# EAGLE design SEGmeterShield15 (EAGLE 6.2)
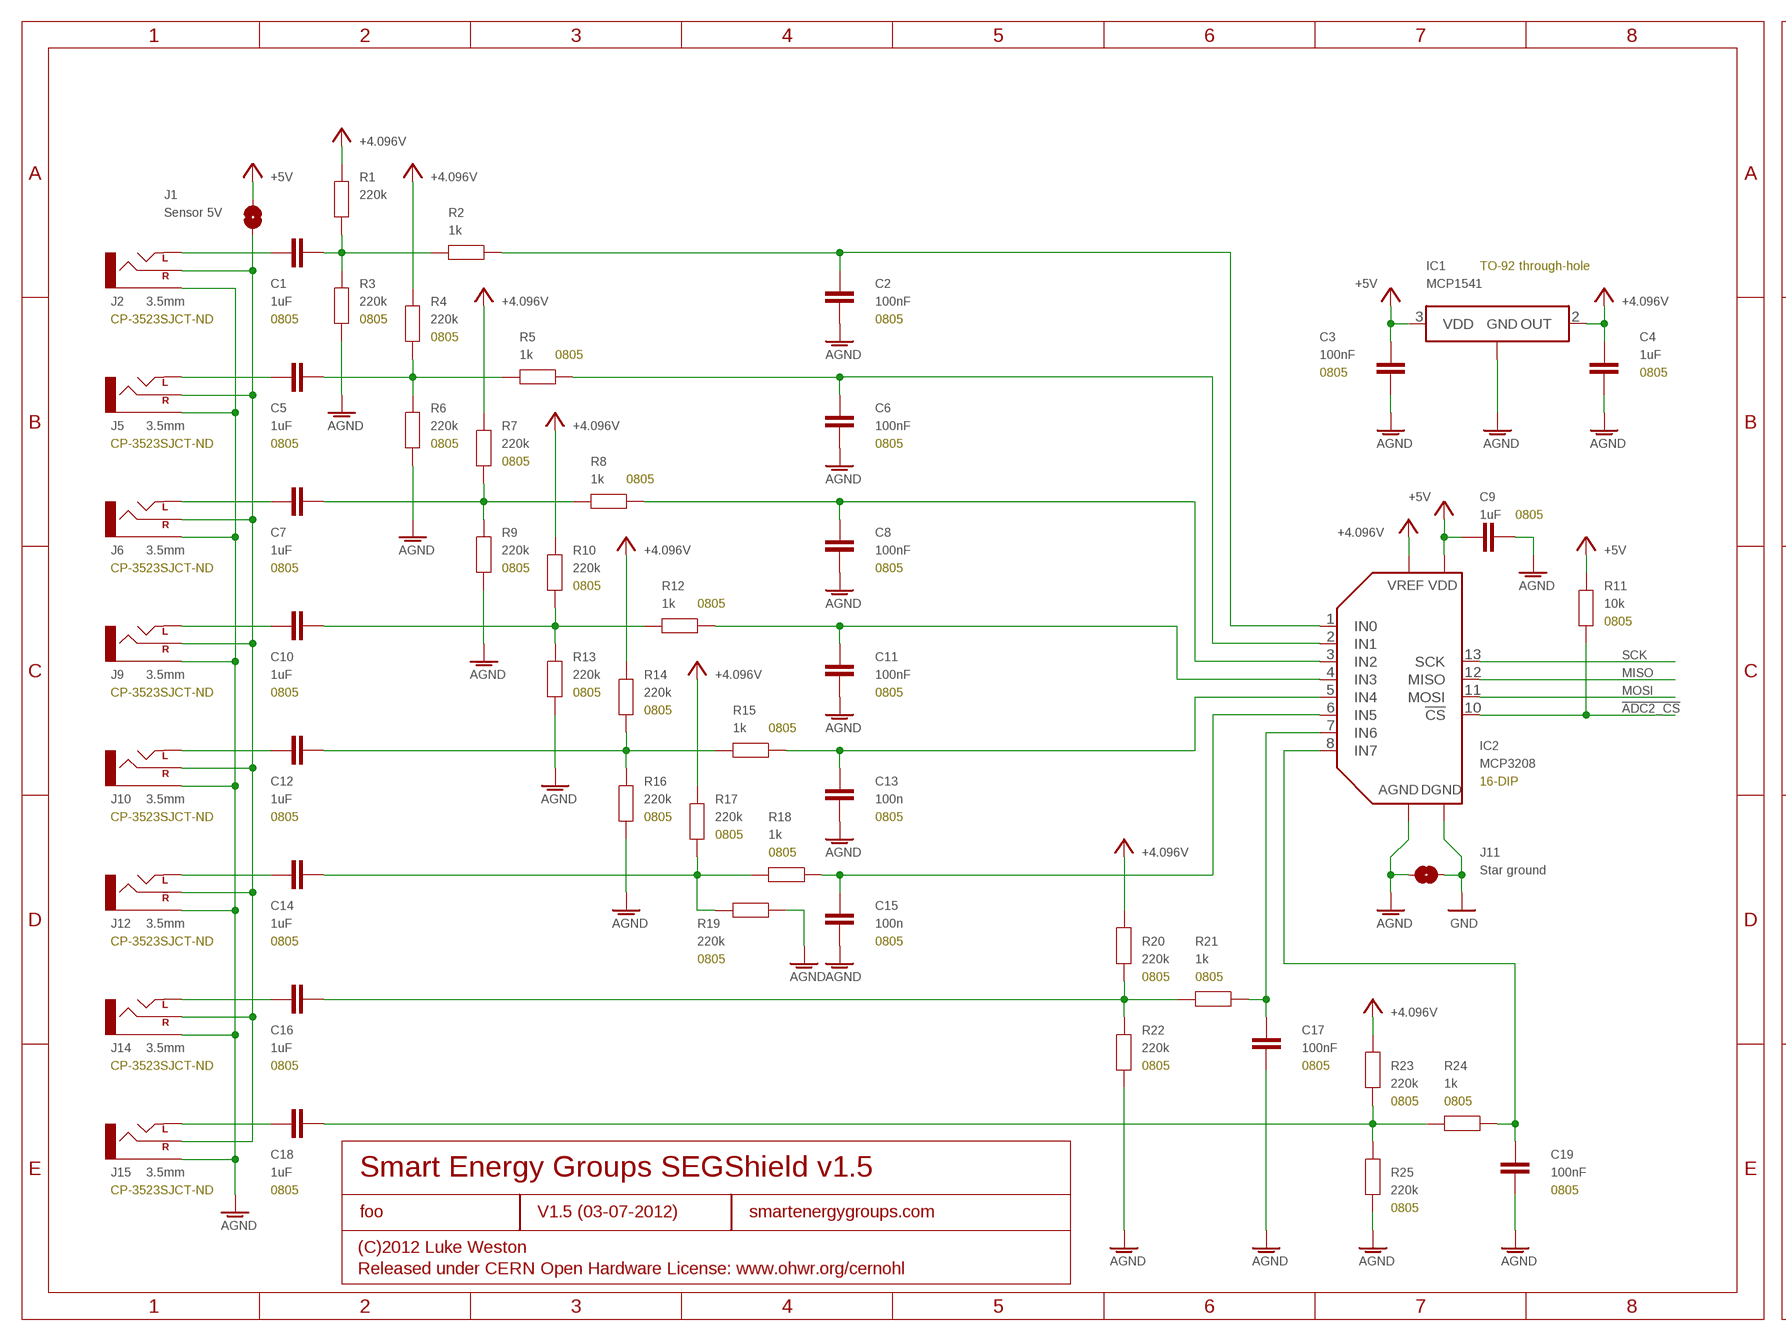
[diagram p0: schematic, sheet 1, part 1 of 2]
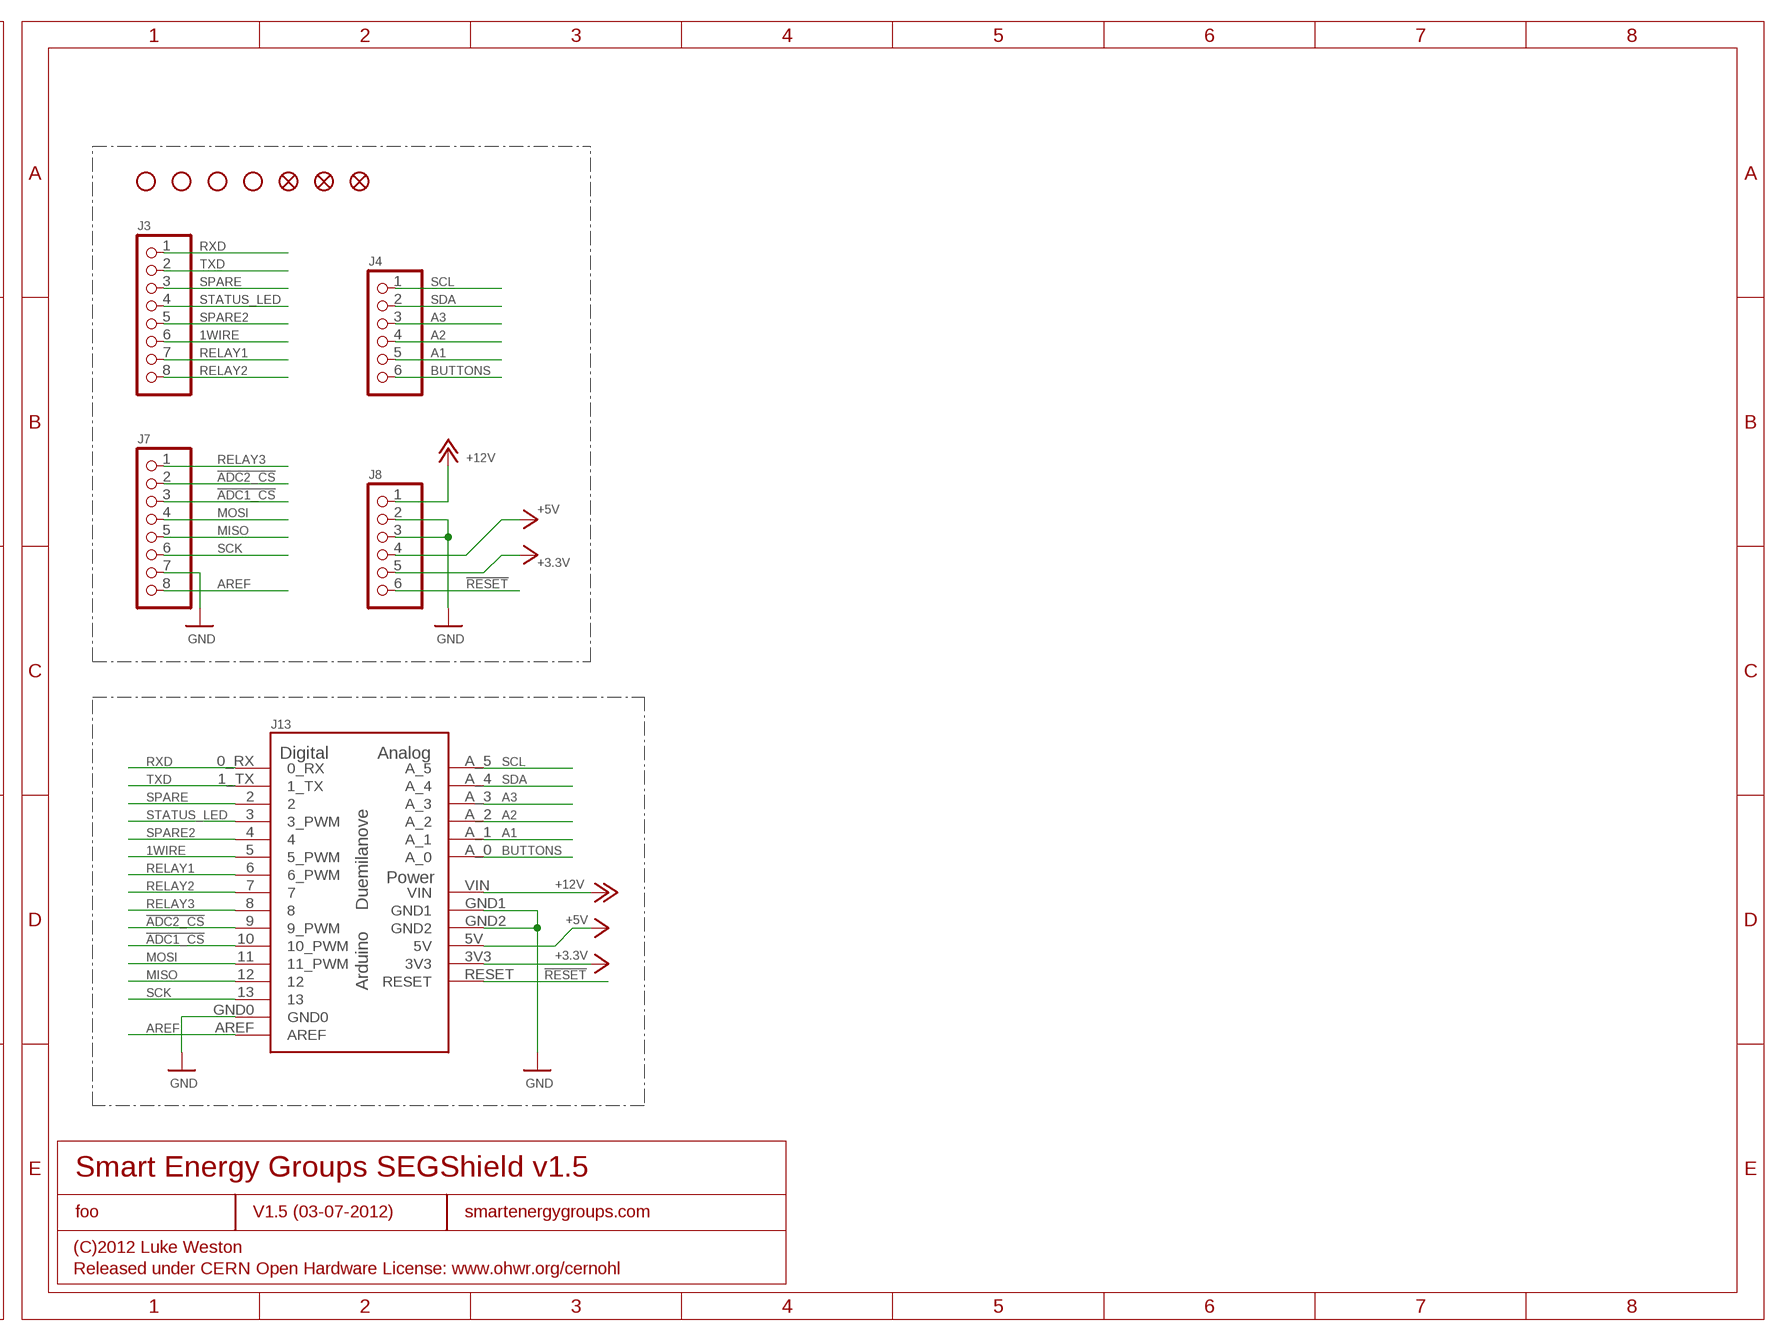
[diagram p1: schematic, sheet 1, part 2 of 2]

## Parts
C1  1uF  CAP0805  [0805]
C2  100nF  CAP0805  [0805]
C3  100nF  CAP0805  [0805]
C4  1uF  CAP0805  [0805]
C5  1uF  CAP0805  [0805]
C6  100nF  CAP0805  [0805]
C7  1uF  CAP0805  [0805]
C8  100nF  CAP0805  [0805]
C9  1uF  CAP0805  [0805]
C10  1uF  CAP0805  [0805]
C11  100nF  CAP0805  [0805]
C12  1uF  CAP0805  [0805]
C13  100n  CAP0805  [0805]
C14  1uF  CAP0805  [0805]
C15  100n  CAP0805  [0805]
C16  1uF  CAP0805  [0805]
C17  100nF  CAP0805  [0805]
C18  1uF  CAP0805  [0805]
C19  100nF  CAP0805  [0805]
IC1  MCP1541  [TO92-STRAIGHT]
IC2  MCP3208  MCP3208DIL  [DIL16]
J1  Sensor 5V  SJ  [SJ]
J2  3.5mm  AUDIO-JACKSMD2  [AUDIO-JACK-3.5MM-SMD]
J3  PINHD-1X8  [1X08]
J4  PINHD-1X6  [1X06]
J5  3.5mm  AUDIO-JACKSMD2  [AUDIO-JACK-3.5MM-SMD]
J6  3.5mm  AUDIO-JACKSMD2  [AUDIO-JACK-3.5MM-SMD]
J7  PINHD-1X8  [1X08]
J8  PINHD-1X6  [1X06]
J9  3.5mm  AUDIO-JACKSMD2  [AUDIO-JACK-3.5MM-SMD]
J10  3.5mm  AUDIO-JACKSMD2  [AUDIO-JACK-3.5MM-SMD]
J11  Star ground  SJ  [SJ]
J12  3.5mm  AUDIO-JACKSMD2  [AUDIO-JACK-3.5MM-SMD]
J13  Arduino-compatible headers  ARDUINO-USBNO-OUTLINE-NO-TEXT-OCTAGONAL  [NO-OUTLINE-OCTAGONAL-NOTEXT]
J14  3.5mm  AUDIO-JACKSMD2  [AUDIO-JACK-3.5MM-SMD]
J15  3.5mm  AUDIO-JACKSMD2  [AUDIO-JACK-3.5MM-SMD]
JP1  STAND-OFF  [STAND-OFF]
JP2  STAND-OFF  [STAND-OFF]
JP3  STAND-OFF  [STAND-OFF]
JP4  STAND-OFF  [STAND-OFF]
JP5  FIDUCIAL1.5X3  [FIDUCIAL-1.5X3]
JP6  FIDUCIAL1.5X3  [FIDUCIAL-1.5X3]
JP7  FIDUCIAL1.5X3  [FIDUCIAL-1.5X3]
R1  220k  RESISTOR0805  [0805]
R2  1k  RESISTOR0805  [0805]
R3  220k  RESISTOR0805  [0805]
R4  220k  RESISTOR0805  [0805]
R5  1k  RESISTOR0805  [0805]
R6  220k  RESISTOR0805  [0805]
R7  220k  RESISTOR0805  [0805]
R8  1k  RESISTOR0805  [0805]
R9  220k  RESISTOR0805  [0805]
R10  220k  RESISTOR0805  [0805]
R11  10k  RESISTOR0805  [0805]
R12  1k  RESISTOR0805  [0805]
R13  220k  RESISTOR0805  [0805]
R14  220k  RESISTOR0805  [0805]
R15  1k  RESISTOR0805  [0805]
R16  220k  RESISTOR0805  [0805]
R17  220k  RESISTOR0805  [0805]
R18  1k  RESISTOR0805  [0805]
R19  220k  RESISTOR0805  [0805]
R20  220k  RESISTOR0805  [0805]
R21  1k  RESISTOR0805  [0805]
R22  220k  RESISTOR0805  [0805]
R23  220k  RESISTOR0805  [0805]
R24  1k  RESISTOR0805  [0805]
R25  220k  RESISTOR0805  [0805]

## Nets
1WIRE: J3.6 J13.5(5_PWM)
!ADC1_CS: J7.3 J13.10(10_PWM)
!ADC2_CS: IC2.10(!CS) J7.2 J13.9(9_PWM) R11.1
!RESET: J8.6 J13.RESET
+3V3: J8.5 J13.3V3 ; supply symbol labelled +3.3V
+5V: C3.2 C9.2 IC1.3(VDD) IC2.16(VDD) J1.2 J8.4 J13.5V R11.2
+12V: J8.1 J13.VIN
A1: J4.5 J13.A_1
A2: J4.4 J13.A_2
A3: J4.3 J13.A_3
AGND: C2.1 C3.1 C4.1 C6.1 C8.1 C9.1 C11.1 C13.1 C15.1 C17.1 C19.1 IC1.1(GND) IC2.14(AGND) J2.SLEEVE J5.SLEEVE J6.SLEEVE J9.SLEEVE J10.SLEEVE J11.2 J12.SLEEVE J14.SLEEVE J15.SLEEVE R3.1 R6.1 R9.1 R13.1 R16.1 R19.1 R22.1 R25.1
AREF: J7.8 J13.AREF
BUTTONS: J4.6 J13.A_0
GND: IC2.9(DGND) J7.7 J8.2 J8.3 J11.1 J13.GND0 J13.GND1 J13.GND2
MISO: IC2.12(MISO) J7.5 J13.12
MOSI: IC2.11(MOSI) J7.4 J13.11(11_PWM)
N$30: C18.1 J15.TIP(LEFT)
N$41: C16.1 J14.TIP(LEFT)
N$42: C1.1 J2.TIP(LEFT)
N$44: C5.1 J5.TIP(LEFT)
N$45: C14.1 J12.TIP(LEFT)
N$46: J1.1 J2.RING(RIGHT) J5.RING(RIGHT) J6.RING(RIGHT) J9.RING(RIGHT) J10.RING(RIGHT) J12.RING(RIGHT) J14.RING(RIGHT) J15.RING(RIGHT)
N$47: C12.1 J10.TIP(LEFT)
N$48: C10.1 J9.TIP(LEFT)
N$49: C7.1 J6.TIP(LEFT)
N$50: C1.2 R1.1 R2.2 R3.2
N$51: C18.2 R23.1 R24.2 R25.2
N$52: C16.2 R20.1 R21.2 R22.2
N$53: C14.2 R17.1 R18.2 R19.2
N$54: C12.2 R14.1 R15.2 R16.2
N$55: C5.2 R4.1 R5.2 R6.2
N$56: C7.2 R7.1 R8.2 R9.2
N$57: C10.2 R10.1 R12.2 R13.2
N$59: C17.2 IC2.7(IN6) R21.1
N$60: C6.2 IC2.2(IN1) R5.1
N$62: C8.2 IC2.3(IN2) R8.1
N$63: C11.2 IC2.4(IN3) R12.1
N$64: C13.2 IC2.5(IN4) R15.1
N$65: C19.2 IC2.8(IN7) R24.1
N$67: C15.2 IC2.6(IN5) R18.1
N$70: C2.2 IC2.1(IN0) R2.1
RELAY1: J3.7 J13.6(6_PWM)
RELAY2: J3.8 J13.7
RELAY3: J7.1 J13.8
RXD: J3.1 J13.0_RX
SCK: IC2.13(SCK) J7.6 J13.13
SCL: J4.1 J13.A_5
SDA: J4.2 J13.A_4
SPARE: J3.3 J13.2
SPARE2: J3.5 J13.4
STATUS_LED: J3.4 J13.3(3_PWM)
TXD: J3.2 J13.1_TX
V+: C4.2 IC1.2(OUT) IC2.15(VREF) R1.2 R4.2 R7.2 R10.2 R14.2 R17.2 R20.2 R23.2 ; supply symbol labelled +4.096V

## Notes on the sheet
- TO-92 through-hole
- CP-3523SJCT-ND | 0805 | 0805 | 0805
- 0805
- 0805
- 0805 | 0805
- CP-3523SJCT-ND | 0805 | 0805 | 0805
- 0805
- 0805
- 0805
- CP-3523SJCT-ND | 0805 | 0805 | 0805
- 0805
- 0805
- 0805
- CP-3523SJCT-ND | 0805 | 0805 | 0805
- 0805
- 0805
- 16-DIP
- CP-3523SJCT-ND | 0805 | 0805 | 0805
- 0805
- 0805
- CP-3523SJCT-ND | 0805 | 0805
- 0805
- 0805 | 0805
- CP-3523SJCT-ND | 0805 | 0805 | 0805
- 0805 | 0805
- Smart Energy Groups SEGShield v1.5 | Smart Energy Groups SEGShield v1.5
- CP-3523SJCT-ND | 0805 | 0805
- 0805
- foo | V1.5 (03-07-2012) | smartenergygroups.com | foo | V1.5 (03-07-2012) | smartenergygroups.com
- (C)2012 Luke Weston | (C)2012 Luke Weston
- Released under CERN Open Hardware License: www.ohwr.org/cernohl | Released under CERN Open Hardware License: www.ohwr.org/cernohl

## Library data of the parts
C1-C19 = freetronics-master-v1:CAP: Capacitor Standard 0603 ceramic capacitor, and 0.1" leaded capacitor.
IC1 = freetronics-luke:MCP1541: Microchip MCP1541 4.096V voltage reference.
IC2 = Luke:MCP3208
J1 J11 = freetronics-luke:SJ: PCB "solder jumper". Note that there should nothing on the BOM corresponding to this "component".
J2 J5 J6 J9 J10 J12 J14 J15 = SparkFun:AUDIO-JACK: 3.5mm Audio Jack Simple 3.5mm common PCB mount audio jack. SKU: PRT-08032
J3 J7 = pinhead:PINHD-1X8: PIN HEADER
J4 J8 = pinhead:PINHD-1X6: PIN HEADER
J13 = Arduino-Various:ARDUINO-USB: The Ardiuno Duemilanove Pinouts layoutet as a Bare Shield. v0.5 Also for Arduino Diecimila. This is designed as a Part and has no Outline in the Dimension Layer. The Outline, when present, is drawed at the tPlace / bPlace Layer. Library by Stephanie Lange, http://www.k-ita.de/~sl/
JP1-JP4 = SparkFun:STAND-OFF: Stand Off This is the mechanical footprint for a #4 phillips button head screw. Use the keepout ring to avoid running the screw head into surrounding components. SKU : PRT-00447
JP5-JP7 = SparkFun:FIDUCIAL: Fiducial Alignment Points Various fiducial points for machine vision alignment.
R1-R25 = freetronics-master-v1:RESISTOR: Resistor Basic schematic elements and footprints for 0603, 1206, and PTH 1/10th watt (small) resistors.

## Board
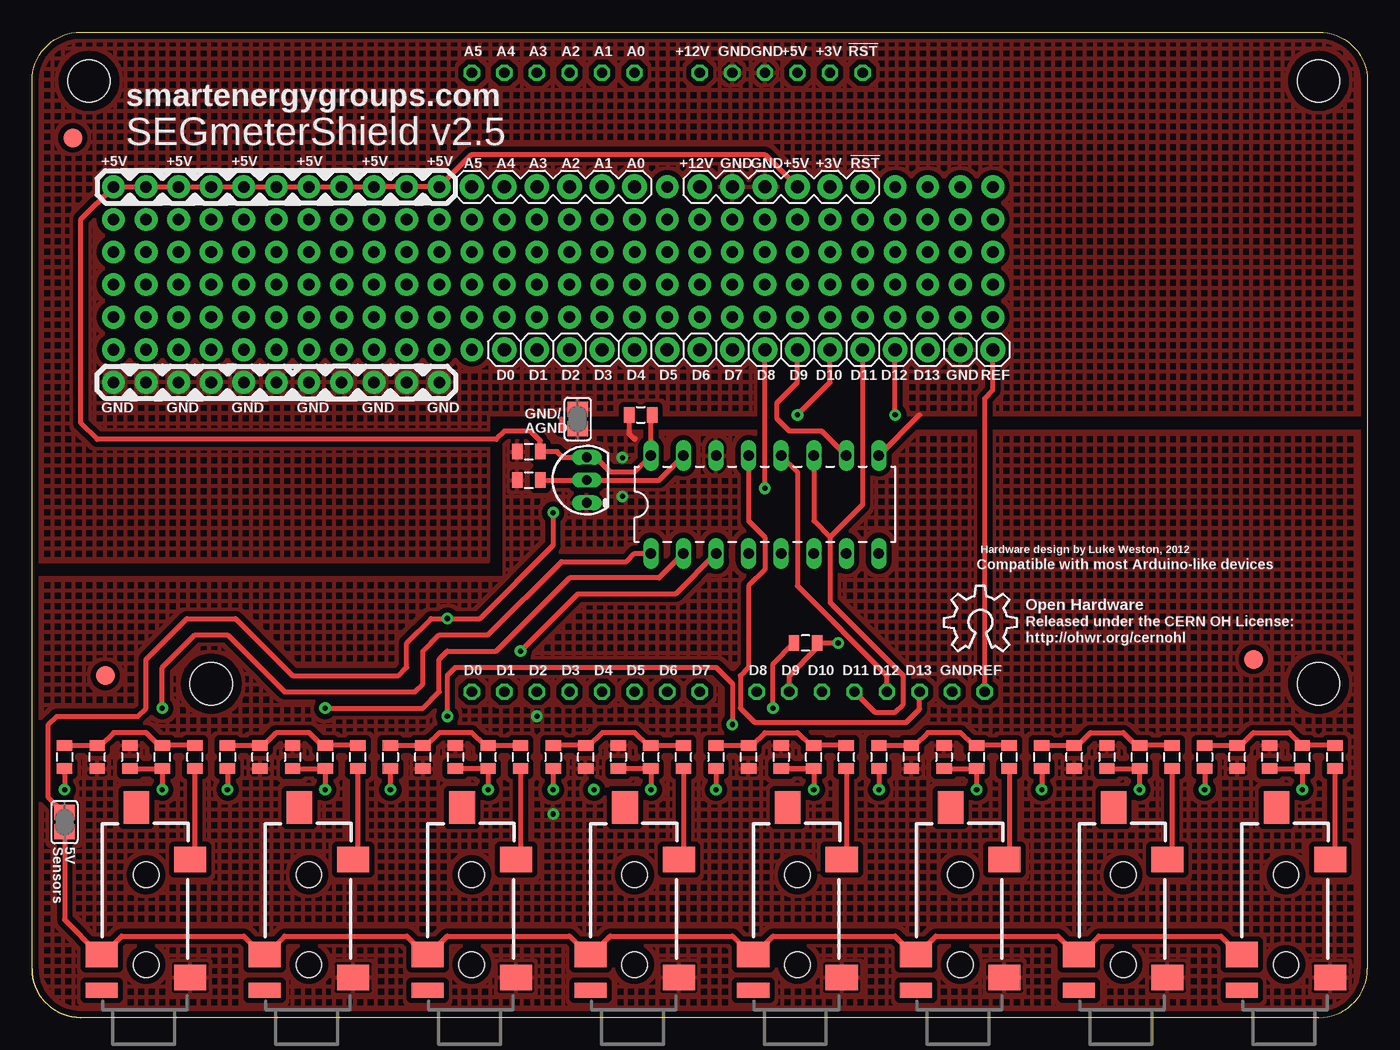
[diagram p2: board, top side]
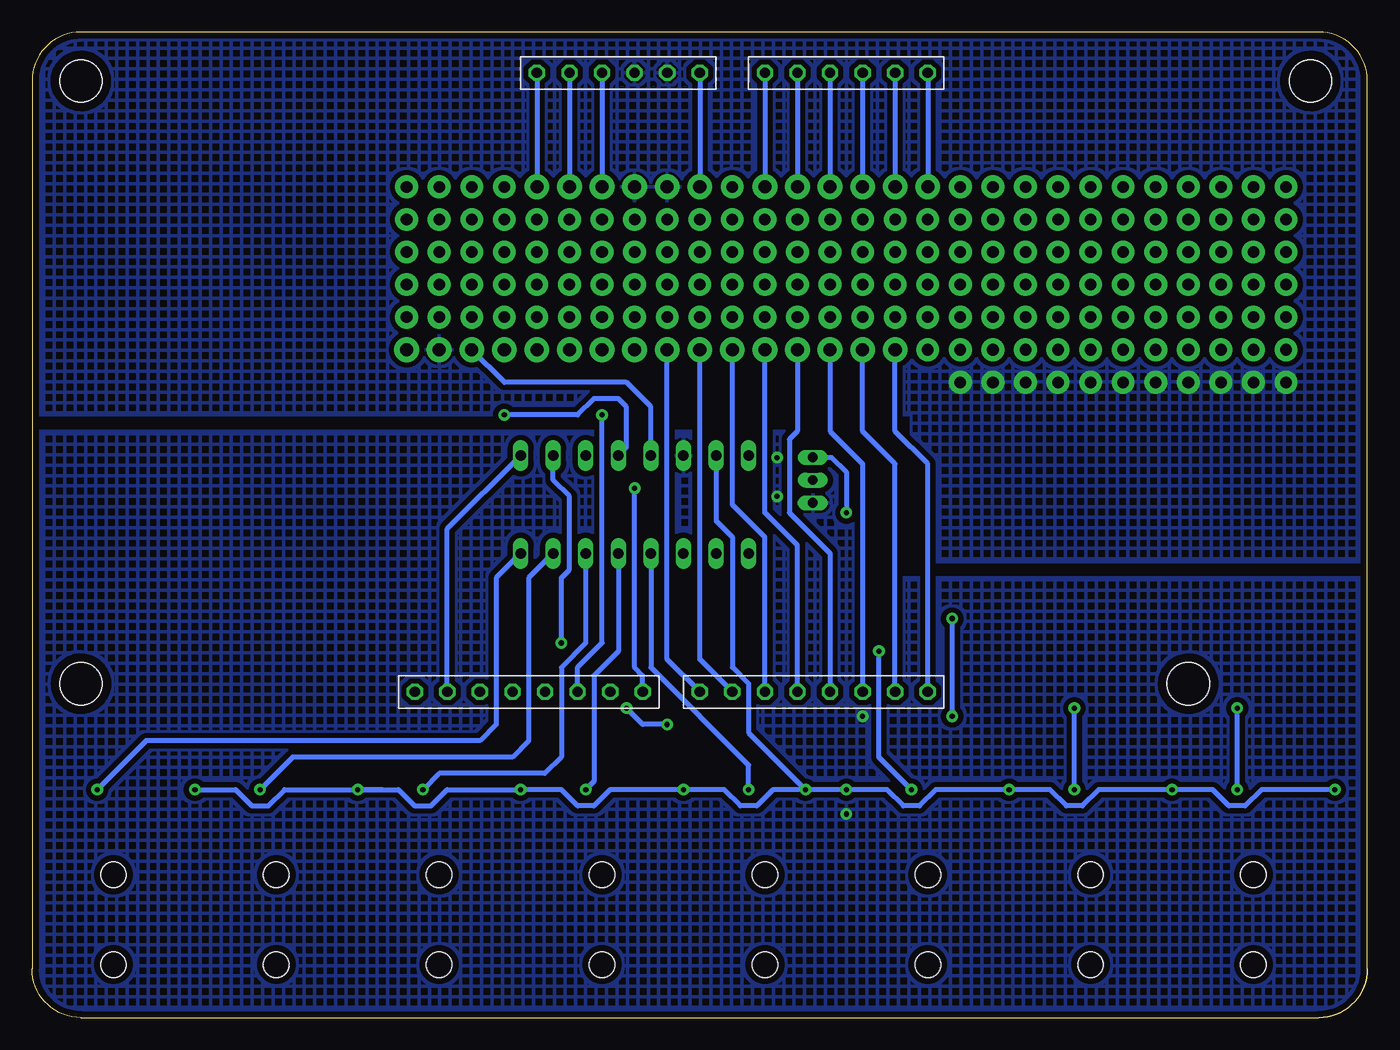
[diagram p3: board, bottom side, seen from below]

Size 104.14 x 76.83 mm. Coordinates in mm from the lower left corner, seen from the top.
Outline: 3.81,0 100.33,0 arc90 104.14,3.81 104.14,73.03 arc90 100.33,76.83 3.81,76.83 arc90 0,73.03 0,3.81
Outline: 3.81,0 arc-90 0,3.81
Outline: 0,3.81 arc90 3.81,0
Copper layers (1*16): Top 0.035mm / dielectric 1.5mm / Bottom 0.035mm
Design rules: minimum track width 8mil, minimum drill 0.4mm, track to track 8mil, track to pad 8mil, pad to pad 8mil, via to via 8mil, smd to smd 8mil, copper to edge 20mil, drill to drill 8mil, minimum pad ring 8mil, minimum via ring 10mil, stop-mask expansion 3mil, vias tented up to drill 25mil, thermal gap 8mil

### Footprints (pad centres in the part's own frame; a part is rotated, then mirrored left to right if it is on the bottom)
0805 = smd 0.8 x 1.2: 1 -0.9,0; 2 0.9,0
TO92-STRAIGHT = drill 0.762 pad 1.1 long: 1 -1.778,0; 2 0,0; 3 1.778,0
DIL16 = drill 0.813 long: 1 -8.89,-3.81; 2 -6.35,-3.81; 3 -3.81,-3.81; 4 -1.27,-3.81; 5 1.27,-3.81; 6 3.81,-3.81; 7 6.35,-3.81; 8 8.89,-3.81; 9 8.89,3.81; 10 6.35,3.81; 11 3.81,3.81; 12 1.27,3.81; 13 -1.27,3.81; 14 -3.81,3.81; 15 -6.35,3.81; 16 -8.89,3.81
SJ = smd 1.168 x 1.6: 1 -0.762,0; 2 0.762,0
AUDIO-JACK-3.5MM-SMD = smd 2 x 2.5: RING 4.3,3.45; SLEEVE 2.5,-3.45; TIP 11.7,-3.45 | smd 1.2 x 2.5: RSH 1.5,3.45 | smd 2.5 x 2: TSH 15.75,0.75 | hole 2: 3.5,0; 10.5,0
1X08 = drill 1.016 pad 1.93: 1 -8.89,0; 2 -6.35,0; 3 -3.81,0; 4 -1.27,0; 5 1.27,0; 6 3.81,0; 7 6.35,0; 8 8.89,0
1X06 = drill 1.016 pad 1.93: 1 -6.35,0; 2 -3.81,0; 3 -1.27,0; 4 1.27,0; 5 3.81,0; 6 6.35,0
NO-OUTLINE-OCTAGONAL-NOTEXT = drill 0.8 pad 1.27 octagon: 0_RX -25.4,27.94; 1_TX -25.4,25.4; 2 -25.4,22.86; 3 -25.4,20.32; 3V3 22.86,0; 4 -25.4,17.78; 5 -25.4,15.24; 5V 22.86,2.54; 6 -25.4,12.7; 7 -25.4,10.16; 8 -25.4,5.715; 9 -25.4,3.175; 10 -25.4,0.635; 11 -25.4,-1.905; 12 -25.4,-4.445; 13 -25.4,-6.985; A_0 22.86,15.24; A_1 22.86,17.78; A_2 22.86,20.32; A_3 22.86,22.86; A_4 22.86,25.4; A_5 22.86,27.94; AREF -25.4,-12.065; GND0 -25.4,-9.525; GND1 22.86,7.62; GND2 22.86,5.08; RESET 22.86,-2.54; VIN 22.86,10.16
STAND-OFF = hole 3.302: 0,0
FIDUCIAL-1.5X3 = smd 1.5 x 1.5: 1 0,0

### Placement (x,y rotation side)
C1  12.7,20.32 90 top
C2  7.62,20.32 270 top
C3  38.73,44.13 0 top
C4  38.73,41.91 0 top
C5  25.4,20.32 90 top
C6  20.32,20.32 270 top
C7  38.1,20.32 90 top
C8  33.02,20.32 270 top
C9  47.47,46.99 0 top
C10  50.8,20.32 90 top
C11  45.72,20.32 270 top
C12  63.5,20.32 90 top
C13  58.42,20.32 270 top
C14  76.2,20.32 90 top
C15  71.12,20.32 270 top
C16  88.9,20.32 90 top
C17  83.82,20.32 270 top
C18  101.6,20.32 90 top
C19  96.52,20.32 270 top
IC1  43.26,41.91 90 top
IC2  57.15,40.01 0 top
J1  2.54,15.24 90 top
J2  8.89,0.64 90 top
J3  45.72,52.07 0 top
J4  40.64,64.77 0 top
J5  21.59,0.64 90 top
J6  34.29,0.64 90 top
J7  66.04,52.07 0 top
J8  58.42,64.77 0 top
J9  46.99,0.64 90 top
J10  59.69,0.64 90 top
J11  42.55,46.67 270 top
J12  72.39,0.64 90 top
J13  62.23,50.8 90 top
J14  85.09,0.64 90 top
J15  97.79,0.64 90 top
JP1  13.97,26.04 0 top
JP2  4.45,73.03 0 top
JP3  100.33,73.03 0 top
JP4  100.33,26.04 180 top
JP5  5.71,26.67 0 top
JP6  3.17,68.58 0 top
JP7  95.25,27.94 0 top
R1  2.54,20.32 270 top
R2  10.16,20.32 90 top
R3  5.08,20.32 90 top
R4  15.24,20.32 270 top
R5  22.86,20.32 90 top
R6  17.78,20.32 90 top
R7  27.94,20.32 270 top
R8  35.56,20.32 90 top
R9  30.48,20.32 90 top
R10  40.64,20.32 270 top
R11  60.33,29.21 180 top
R12  48.26,20.32 90 top
R13  43.18,20.32 90 top
R14  53.34,20.32 270 top
R15  60.96,20.32 90 top
R16  55.88,20.32 90 top
R17  66.04,20.32 270 top
R18  73.66,20.32 90 top
R19  68.58,20.32 90 top
R20  78.74,20.32 270 top
R21  86.36,20.32 90 top
R22  81.28,20.32 90 top
R23  91.44,20.32 270 top
R24  99.06,20.32 90 top
R25  93.98,20.32 90 top
U$1  [OSHW_8X200_NOTEXT]  71.12,28.57 0 top

### Tracks (layer width: path | path; a pad name or v marks a point on that pad's centre or on a via)
1WIRE
  Bottom 0.406: J13.5 46.99,37.47 49.53,40.01 J3.6
!ADC1_CS  (via drill 0.4)
  Top 0.406: v59.69,46.99 62.23,49.53 J7.3
  Bottom 0.406: J13.10 61.59,27.3 59.69,29.21 v59.69,46.99
!ADC2_CS  (via drill 0.4)
  Top 0.406: IC2.10 61.59,45.72 59.05,45.72 58.1,46.67 58.1,47.94 59.69,49.53 J7.2 | v62.87,29.21 R11.1 61.23,28.84 59.05,26.67 J13.9
  Bottom 0.406: v62.87,29.21 62.87,34.29 62.23,34.92 62.23,40.64 63.5,41.91 IC2.10
!RESET
  Bottom 0.406: J13.RESET J8.6
+3V3
  Bottom 0.406: J13.3V3 J8.5
+5V  (via drill 0.4, 0.9 pad 1.78)
  Top 0.406: 48.13,43.69 IC2.16 | J1.2 2.41,16 1.27,17.14 1.27,22.86 1.91,23.5 8.26,23.5 8.89,24.13 8.89,27.94 12.06,31.11 15.88,31.11 20.32,26.67 28.57,26.67 29.21,27.3 29.21,29.21 31.11,31.11 v32.38,31.11 34.92,31.11 40.64,36.83 v40.64,39.37 | IC2.16 48.26,46.88 C9.2 | v32.38,23.5 32.38,26.67 33.02,27.3 53.34,27.3 54.61,26.04 v54.61,22.86 | J8.4 57.15,67.31 34.29,67.31 v31.75,64.77 v29.21,64.77 v26.67,64.77 v24.13,64.77 v21.59,64.77 v19.05,64.77 v16.51,64.77 v13.97,64.77 v11.43,64.77 v8.89,64.77 v6.35,64.77 3.81,62.23 3.81,46.35 5.08,45.09 36.2,45.09 36.83,45.72 38.89,45.72 39.63,44.98 C3.2 40.96,44.13 41.4,43.69 IC1.3 43.94,43.69 45.09,42.55 46.99,42.55 IC2.16 | v57.78,24.13 57.78,27.57 R11.2
  Bottom 0.406: IC1.3 41.78,43.69 40.64,42.55 v40.64,39.37 | J13.5V J8.4 | v32.38,23.5 v32.38,31.11 | v54.61,22.86 56.52,22.86 v57.78,24.13
+12V
  Bottom 0.406: J13.VIN J8.1
A1
  Bottom 0.406: J13.A_1 J4.5
A2
  Bottom 0.406: J13.A_2 J4.4
A3
  Bottom 0.406: J13.A_3 J4.3
AGND  (via drill 0.4)
  Top 0.406: 47.04,45.14 46.99,45.09 46.57,45.51 C9.1
  other vias: 39.37,23.5 46.04,43.66 46.04,40.64 40.64,15.88
  pour Bottom (isolate 0.406, hatched): -0.64,34.29 36.83,34.29 36.83,45.72 104.78,45.72 104.78,-0.64 -0.64,-0.64
  pour Top (isolate 0.406, hatched): -0.64,34.29 36.83,34.29 36.83,45.72 104.78,45.72 104.78,-0.64 -0.64,-0.64
AREF
  Top 0.406: J13.AREF 74.3,48.26 74.93,48.9 J7.8
BUTTONS
  Bottom 0.406: J13.A_0 J4.6
GND  (via drill 0.9 pad 1.78)
  Top 0.406: IC2.9 69.22,46.99
  Bottom 0.406: J13.GND0 71.75,38.1 IC2.9
  other vias: 31.75,49.53 29.21,49.53 26.67,49.53 24.13,49.53 21.59,49.53 19.05,49.53 16.51,49.53 13.97,49.53 11.43,49.53 8.89,49.53 6.35,49.53
  pour Bottom (isolate 0.406, hatched): -0.64,35.56 35.56,35.56 35.56,46.99 104.78,46.99 104.78,77.47 -0.69,77.5
  pour Top (isolate 0.406, hatched): -0.64,77.47 104.78,77.47 104.78,46.99 35.56,46.99 35.56,35.56 -0.64,35.56
MISO  (via drill 0.4)
  Top 0.406: IC2.12 59.69,42.55 59.69,33.66 66.67,26.67 J13.12 | v67.31,46.99 J7.5
  Bottom 0.406: IC2.12 57.78,44.45 57.78,47.62 58.42,48.26 60.33,48.26 61.59,46.99 v67.31,46.99
MOSI
  Top 0.406: IC2.11 60.96,38.73 62.23,37.47 | 62.23,37.47 62.23,32.38 67.94,26.67 67.94,24.45 67.31,23.81 65.72,23.81 J13.11 | J7.4 64.77,40.01 62.23,37.47
N$1  (via drill 0.9 pad 1.78)
  other vias: 59.69,54.61
N$2  (via drill 0.9 pad 1.78)
  other vias: 62.23,54.61
N$3
  Top 0.406: 41.27,46.67 41.27,45.88
N$5  (via drill 0.9 pad 1.78)
  other vias: 6.35,57.15
N$25  (via drill 0.9 pad 1.78)
  other vias: 74.93,62.23
N$26  (via drill 0.9 pad 1.78)
  other vias: 8.89,62.23
N$27  (via drill 0.9 pad 1.78)
  other vias: 8.89,59.69
N$28  (via drill 0.9 pad 1.78)
  other vias: 36.83,54.61
N$29  (via drill 0.9 pad 1.78)
  other vias: 39.37,57.15
N$30
  Top 0.406: C18.1 101.6,12.7 J15.TIP
N$31  (via drill 0.9 pad 1.78)
  other vias: 74.93,57.15
N$32  (via drill 0.9 pad 1.78)
  other vias: 39.37,59.69
N$33  (via drill 0.9 pad 1.78)
  other vias: 39.37,62.23
N$34  (via drill 0.9 pad 1.78)
  other vias: 69.85,64.77
N$41
  Top 0.406: C16.1 88.9,12.7 J14.TIP
N$42
  Top 0.406: C1.1 12.7,12.7 J2.TIP
N$44
  Top 0.406: C5.1 25.4,12.7 J5.TIP
N$45
  Top 0.406: C14.1 76.2,12.7 J12.TIP
N$46
  Top 0.406: J15.RING 94.19,5.08 93.98,5.08 92.71,6.35 83.19,6.35 81.77,4.93 J14.RING 81.5,5.08 81.28,5.08 80.01,6.35 70.48,6.35 69.07,4.93 J12.RING 68.8,5.08 68.58,5.08 67.31,6.35 57.78,6.35 56.37,4.93 J10.RING 56.09,5.08 55.88,5.08 54.61,6.35 45.09,6.35 43.67,4.93 J9.RING 43.4,5.08 43.18,5.08 41.91,6.35 32.38,6.35 30.97,4.93 J6.RING 30.7,5.08 30.48,5.08 29.21,6.35 19.68,6.35 18.27,4.93 J5.RING 18,5.08 17.78,5.08 16.51,6.35 6.99,6.35 5.57,4.93 J2.RING 5.29,5.08 5.08,5.08 2.54,7.62 J1.1
N$47
  Top 0.406: C12.1 63.5,12.7 J10.TIP
N$48
  Top 0.406: C10.1 50.8,12.7 J9.TIP
N$49
  Top 0.406: C7.1 38.1,12.7 J6.TIP
N$50
  Top 0.406: 10.16,21.03 R2.2 | C1.2 R2.2 | R1.1 R3.2 | 5.08,21.19 R3.2 | R3.2 5.34,21.22 6.35,22.23 8.89,22.23 9.89,21.22 R2.2
N$51
  Top 0.406: R23.1 R25.2 94.25,21.22 95.25,22.23 98.06,22.23 R24.2 C18.2
N$52
  Top 0.406: C16.2 R21.2 86.09,21.22 85.09,22.23 82.55,22.23 81.55,21.22 R22.2 R20.1
N$53
  Top 0.406: C14.2 R18.2 73.39,21.22 72.39,22.23 69.85,22.23 68.84,21.22 R19.2 R17.1
N$54
  Top 0.406: C12.2 R15.2 60.7,21.22 59.69,22.23 57.15,22.23 56.15,21.22 R16.2 R14.1
N$55
  Top 0.406: R4.1 R6.2 18.05,21.22 19.05,22.23 21.59,22.23 22.59,21.22 R5.2 C5.2
N$56
  Top 0.406: R7.1 R9.2 30.75,21.22 31.75,22.23 34.29,22.23 35.3,21.22 R8.2 C7.2
N$57
  Top 0.406: C10.2 R12.2 47.99,21.22 46.99,22.23 44.45,22.23 43.45,21.22 R13.2 R10.1
N$59  (via drill 0.4)
  Top 0.406: R21.1 C17.2 86.33,19.42 86.36,19.45 v86.36,17.78
  Bottom 0.406: IC2.7 65.41,34.29 65.41,21.59 66.67,20.32 83.82,20.32 v86.36,17.78
N$60  (via drill 0.4)
  Top 0.406: C6.2 R5.1 v22.86,17.78 | IC2.2 48.9,34.29 41.91,34.29 36.2,28.57 32.38,28.57 31.75,27.94 31.75,25.4 30.48,24.13 v22.86,24.13
  Bottom 0.406: v22.86,17.78 v22.86,24.13
N$62  (via drill 0.4)
  Top 0.406: C8.2 R8.1 v35.56,17.78 | IC2.3 50.16,33.02 42.55,33.02 v38.1,28.57
  Bottom 0.406: v35.56,17.78 38.1,20.32 v38.1,28.57
N$63  (via drill 0.4)
  Top 0.406: C11.2 R12.1 v48.26,17.78
  Bottom 0.406: v48.26,17.78 48.26,19.68 55.88,27.3 IC2.4
N$64  (via drill 0.4)
  Top 0.406: R15.1 C13.2 60.91,19.42 60.96,19.37 v60.96,17.78
  Bottom 0.406: IC2.5 58.42,28.57 60.33,26.67 60.33,18.41 v60.96,17.78
N$65  (via drill 0.4)
  Top 0.406: R24.1 C19.2 99.03,19.42 99.06,19.45 v99.06,17.78
  Bottom 0.406: IC2.8 67.94,34.29 67.94,22.86 69.22,21.59 95.25,21.59 v99.06,17.78
N$67  (via drill 0.4)
  Top 0.406: R18.1 C15.2 73.63,19.42 73.66,19.45 v73.66,17.78
  Bottom 0.406: IC2.6 60.96,29.21 62.87,27.3 62.87,20.32 64.14,19.05 72.39,19.05 v73.66,17.78
N$70  (via drill 0.4)
  Top 0.406: C2.2 R2.1 v10.16,17.78 | IC2.1 46.99,36.2 46.35,35.56 41.27,35.56 35.56,29.84 31.75,29.84 30.48,28.57 30.48,26.04 29.84,25.4 19.68,25.4 15.24,29.84 12.7,29.84 10.16,27.3 v10.16,24.13
  Bottom 0.406: v10.16,17.78 v10.16,24.13
N$72  (via drill 0.9 pad 1.78)
  other vias: 44.45,54.61
N$73  (via drill 0.9 pad 1.78)
  other vias: 39.37,54.61
N$78  (via drill 0.9 pad 1.78)
  other vias: 72.39,54.61
N$81  (via drill 0.9 pad 1.78)
  other vias: 19.05,62.23
N$82  (via drill 0.9 pad 1.78)
  other vias: 16.51,59.69
N$83  (via drill 0.9 pad 1.78)
  other vias: 11.43,62.23
N$84  (via drill 0.9 pad 1.78)
  other vias: 13.97,59.69
N$85  (via drill 0.9 pad 1.78)
  other vias: 21.59,59.69
N$86  (via drill 0.9 pad 1.78)
  other vias: 24.13,62.23
N$87  (via drill 0.9 pad 1.78)
  other vias: 24.13,59.69
N$88  (via drill 0.9 pad 1.78)
  other vias: 19.05,59.69
N$89  (via drill 0.9 pad 1.78)
  other vias: 21.59,62.23
N$90  (via drill 0.9 pad 1.78)
  other vias: 16.51,62.23
N$92  (via drill 0.9 pad 1.78)
  other vias: 13.97,62.23
N$93  (via drill 0.9 pad 1.78)
  other vias: 26.67,59.69
N$108  (via drill 0.9 pad 1.78)
  other vias: 54.61,62.23
N$109  (via drill 0.9 pad 1.78)
  other vias: 54.61,59.69
N$110  (via drill 0.9 pad 1.78)
  other vias: 54.61,57.15
N$112  (via drill 0.9 pad 1.78)
  other vias: 64.77,54.61
N$113  (via drill 0.9 pad 1.78)
  other vias: 72.39,59.69
N$114  (via drill 0.9 pad 1.78)
  other vias: 54.61,54.61
N$115  (via drill 0.9 pad 1.78)
  other vias: 67.31,54.61
N$116  (via drill 0.9 pad 1.78)
  other vias: 57.15,57.15
N$117  (via drill 0.9 pad 1.78)
  other vias: 57.15,59.69
N$118  (via drill 0.9 pad 1.78)
  other vias: 57.15,62.23
N$120  (via drill 0.9 pad 1.78)
  other vias: 52.07,54.61
N$125  (via drill 0.9 pad 1.78)
  other vias: 59.69,57.15
N$126  (via drill 0.9 pad 1.78)
  other vias: 59.69,59.69
N$127  (via drill 0.9 pad 1.78)
  other vias: 62.23,59.69
N$128  (via drill 0.9 pad 1.78)
  other vias: 64.77,59.69
N$129  (via drill 0.9 pad 1.78)
  other vias: 62.23,57.15
N$130  (via drill 0.9 pad 1.78)
  other vias: 62.23,62.23
N$131  (via drill 0.9 pad 1.78)
  other vias: 59.69,62.23
N$132  (via drill 0.9 pad 1.78)
  other vias: 72.39,62.23
N$133  (via drill 0.9 pad 1.78)
  other vias: 74.93,59.69
N$135  (via drill 0.9 pad 1.78)
  other vias: 64.77,62.23
N$136  (via drill 0.9 pad 1.78)
  other vias: 64.77,57.15
N$137  (via drill 0.9 pad 1.78)
  other vias: 67.31,57.15
N$138  (via drill 0.9 pad 1.78)
  other vias: 67.31,59.69
N$139  (via drill 0.9 pad 1.78)
  other vias: 67.31,62.23
N$140  (via drill 0.9 pad 1.78)
  other vias: 46.99,54.61
N$152  (via drill 0.9 pad 1.78)
  other vias: 74.93,54.61
N$153  (via drill 0.9 pad 1.78)
  other vias: 69.85,57.15
N$154  (via drill 0.9 pad 1.78)
  other vias: 69.85,59.69
N$155  (via drill 0.9 pad 1.78)
  other vias: 69.85,62.23
N$156  (via drill 0.9 pad 1.78)
  other vias: 74.93,64.77
N$184  (via drill 0.9 pad 1.78)
  other vias: 26.67,62.23
N$185  (via drill 0.9 pad 1.78)
  other vias: 49.53,64.77
N$218  (via drill 0.9 pad 1.78)
  other vias: 6.35,54.61
N$219  (via drill 0.9 pad 1.78)
  other vias: 6.35,52.07
N$229  (via drill 0.9 pad 1.78)
  other vias: 31.75,59.69
N$234  (via drill 0.9 pad 1.78)
  other vias: 34.29,62.23
N$284  (via drill 0.9 pad 1.78)
  other vias: 72.39,64.77
N$285  (via drill 0.9 pad 1.78)
  other vias: 36.83,62.23
N$289  (via drill 0.9 pad 1.78)
  other vias: 67.31,64.77
N$294  (via drill 0.9 pad 1.78)
  other vias: 11.43,59.69
N$295  (via drill 0.9 pad 1.78)
  other vias: 31.75,62.23
N$296  (via drill 0.9 pad 1.78)
  other vias: 29.21,62.23
N$297  (via drill 0.9 pad 1.78)
  other vias: 29.21,59.69
N$303  (via drill 0.9 pad 1.78)
  other vias: 69.85,54.61
N$304  (via drill 0.9 pad 1.78)
  other vias: 41.91,62.23
N$305  (via drill 0.9 pad 1.78)
  other vias: 41.91,59.69
N$306  (via drill 0.9 pad 1.78)
  other vias: 41.91,57.15
N$310  (via drill 0.9 pad 1.78)
  other vias: 57.15,54.61
N$350  (via drill 0.9 pad 1.78)
  other vias: 11.43,57.15
N$358  (via drill 0.9 pad 1.78)
  other vias: 13.97,57.15
N$359  (via drill 0.9 pad 1.78)
  other vias: 16.51,57.15
N$360  (via drill 0.9 pad 1.78)
  other vias: 8.89,57.15
N$361  (via drill 0.9 pad 1.78)
  other vias: 8.89,54.61
N$362  (via drill 0.9 pad 1.78)
  other vias: 8.89,52.07
N$365  (via drill 0.9 pad 1.78)
  other vias: 44.45,62.23
N$366  (via drill 0.9 pad 1.78)
  other vias: 44.45,59.69
N$367  (via drill 0.9 pad 1.78)
  other vias: 44.45,57.15
N$368  (via drill 0.9 pad 1.78)
  other vias: 46.99,57.15
N$369  (via drill 0.9 pad 1.78)
  other vias: 46.99,59.69
N$370  (via drill 0.9 pad 1.78)
  other vias: 46.99,62.23
N$372  (via drill 0.9 pad 1.78)
  other vias: 13.97,52.07
N$374  (via drill 0.9 pad 1.78)
  other vias: 11.43,52.07
N$375  (via drill 0.9 pad 1.78)
  other vias: 11.43,54.61
N$376  (via drill 0.9 pad 1.78)
  other vias: 13.97,54.61
N$377  (via drill 0.9 pad 1.78)
  other vias: 16.51,54.61
N$378  (via drill 0.9 pad 1.78)
  other vias: 16.51,52.07
N$381  (via drill 0.9 pad 1.78)
  other vias: 52.07,62.23
N$382  (via drill 0.9 pad 1.78)
  other vias: 52.07,59.69
N$383  (via drill 0.9 pad 1.78)
  other vias: 52.07,57.15
N$384  (via drill 0.9 pad 1.78)
  other vias: 49.53,57.15
N$385  (via drill 0.9 pad 1.78)
  other vias: 49.53,59.69
N$386  (via drill 0.9 pad 1.78)
  other vias: 41.91,54.61
N$387  (via drill 0.9 pad 1.78)
  other vias: 34.29,54.61
N$390  (via drill 0.9 pad 1.78)
  other vias: 19.05,57.15
N$391  (via drill 0.9 pad 1.78)
  other vias: 19.05,54.61
N$392  (via drill 0.9 pad 1.78)
  other vias: 19.05,52.07
N$393  (via drill 0.9 pad 1.78)
  other vias: 6.35,62.23
N$394  (via drill 0.9 pad 1.78)
  other vias: 6.35,59.69
N$417  (via drill 0.9 pad 1.78)
  other vias: 36.83,59.69
N$418  (via drill 0.9 pad 1.78)
  other vias: 36.83,57.15
N$419  (via drill 0.9 pad 1.78)
  other vias: 34.29,52.07
N$442  (via drill 0.9 pad 1.78)
  other vias: 21.59,52.07
N$443  (via drill 0.9 pad 1.78)
  other vias: 21.59,54.61
N$444  (via drill 0.9 pad 1.78)
  other vias: 21.59,57.15
N$447  (via drill 0.9 pad 1.78)
  other vias: 24.13,57.15
N$448  (via drill 0.9 pad 1.78)
  other vias: 24.13,54.61
N$449  (via drill 0.9 pad 1.78)
  other vias: 24.13,52.07
N$459  (via drill 0.9 pad 1.78)
  other vias: 49.53,54.61
N$460  (via drill 0.9 pad 1.78)
  other vias: 34.29,57.15
N$461  (via drill 0.9 pad 1.78)
  other vias: 34.29,59.69
N$468  (via drill 0.9 pad 1.78)
  other vias: 26.67,57.15
N$469  (via drill 0.9 pad 1.78)
  other vias: 26.67,54.61
N$470  (via drill 0.9 pad 1.78)
  other vias: 26.67,52.07
N$474  (via drill 0.9 pad 1.78)
  other vias: 29.21,52.07
N$475  (via drill 0.9 pad 1.78)
  other vias: 29.21,54.61
N$476  (via drill 0.9 pad 1.78)
  other vias: 29.21,57.15
N$477  (via drill 0.9 pad 1.78)
  other vias: 31.75,57.15
N$478  (via drill 0.9 pad 1.78)
  other vias: 31.75,54.61
N$479  (via drill 0.9 pad 1.78)
  other vias: 31.75,52.07
N$486  (via drill 0.9 pad 1.78)
  other vias: 72.39,57.15
N$487  (via drill 0.9 pad 1.78)
  other vias: 49.53,62.23
RELAY1
  Bottom 0.406: J13.6 52.07,27.94 J3.7
RELAY2
  Bottom 0.406: J13.7 54.61,27.94 J3.8
RELAY3  (via drill 0.4)
  Top 0.406: v57.15,41.27 J7.1
  Bottom 0.406: J13.8 56.52,26.67 57.15,27.3 v57.15,41.27
RXD
  Bottom 0.406: J13.0_RX 34.29,43.18 36.83,45.72 J3.1
SCK
  Top 0.406: IC2.13 55.88,38.73 57.15,37.47 57.15,34.92 55.88,33.66 55.88,27.3 55.24,26.67 55.24,24.13 56.36,23.02 68.18,23.02 69.22,24.05 J13.13
  Bottom 0.406: IC2.13 55.88,47.62 57.78,49.53 67.31,49.53 J7.6
SCL
  Bottom 0.406: J13.A_5 J4.1
SDA
  Bottom 0.406: J13.A_4 J4.2
SPARE
  Bottom 0.406: J3.3 41.91,45.72 39.37,43.18 J13.2
SPARE2
  Bottom 0.406: J13.4 44.45,36.83 46.99,39.37 J3.5
STATUS_LED
  Bottom 0.406: J3.4 44.45,45.72 45.09,45.09 45.09,39.37 41.91,36.2 J13.3
TXD
  Bottom 0.406: J13.1_TX 36.83,43.18 39.37,45.72 J3.2
V+  (via drill 0.4)
  Top 0.406: R17.2 v66.04,17.78 | R1.2 v2.54,17.78 | R20.2 v78.74,17.78 | R4.2 v15.24,17.78 | R7.2 v27.94,17.78 | R10.2 v40.64,17.78 | R14.2 v53.34,17.78 | R23.2 v91.44,17.78 | IC2.15 48.9,41.91 IC1.2 C4.2
  Bottom 0.406: v2.54,17.78 8.26,17.78 9.53,16.51 10.79,16.51 12.06,17.78 v15.24,17.78 20.95,17.78 22.23,16.51 23.5,16.51 24.77,17.78 v27.94,17.78 33.66,17.78 34.92,16.51 36.2,16.51 37.47,17.78 v40.64,17.78 v43.81,17.78 | v43.81,17.78 46.35,17.78 47.62,16.51 48.9,16.51 50.16,17.78 v53.34,17.78 59.05,17.78 60.33,16.51 61.59,16.51 62.87,17.78 v66.04,17.78 71.75,17.78 73.03,16.51 74.3,16.51 75.56,17.78 v78.74,17.78 | v91.44,17.78 88.27,17.78 87,16.51 85.72,16.51 84.45,17.78 v78.74,17.78 | 76.83,17.78 v78.74,17.78 | IC2.15 50.8,38.73 49.53,37.47 49.53,27.3 48.26,26.04 48.26,22.23 v43.81,17.78

### Text on the board
tPlace: A5 | A4 | A3 | A2 | A1 | A0 | +12V | GND | GND | +5V | +3V | !RST | smartenergygroups.com | SEGmeterShield v2.5 | +5V | +5V | +5V | +5V | +5V | +5V | A5 | A4 | A3 | A2 | A1 | A0 | +12V | GND | GND | +5V | +3V | !RST | D0 | D1 | D2 | D3 | D4 | D5 | D6 | D7 | D8 | D9 | D10 | D11 | D12 | D13 | GND | REF | GND | GND | GND | GND | GND | GND | GND/ | AGND | Hardware design by Luke Weston, 2012 | Compatible with most Arduino-like devices | Open Hardware | Released under the CERN OH License: | http://ohwr.org/cernohl | D0 | D1 | D2 | D3 | D4 | D5 | D6 | D7 | D8 | D9 | D10 | D11 | D12 | D13 | GND | REF | Sensors | 5V